# Altium schematic sheet Back Panel.schdoc
size 137 x 83 mm
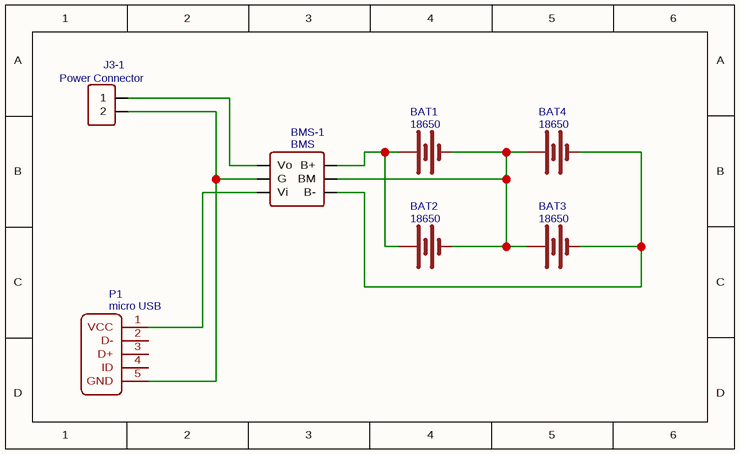
[diagram p0: Back Panel.schdoc]

## Parts
BAT1  18650  [BATTERY_18650-HOLDER]
BAT2  18650  [BATTERY_18650-HOLDER]
BAT3  18650  [BATTERY_18650-HOLDER]
BAT4  18650  [BATTERY_18650-HOLDER]
BMS-1  BMS  [HDR-M-2.54_2X3]
J3-1  Power Connector  [HDR-M-2.54_1X2]
P1  micro USB  [MICROB USB]

## Nets
NetBAT1_GND@1: BAT1.GND@1(-) BAT2.GND@1(-) BAT3.PWR@1(+) BAT4.PWR@1(+) BMS-1.4(BM)
NetBAT1_PWR@1: BAT1.PWR@1(+) BAT2.PWR@1(+) BMS-1.2(B+)
NetBAT3_GND@1: BAT3.GND@1(-) BAT4.GND@1(-) BMS-1.6(B-)
NetBMS-1_1: BMS-1.1(Vo) J3-1.2(1)
NetBMS-1_3: BMS-1.3(G) J3-1.1(2) P1.5(GND)
NetBMS-1_5: BMS-1.5(Vi) P1.1(VCC)

Not connected (* = marked no-connect by the designer): P1 2(D-) 3(D+) 4(ID)

## Library data of the parts
BAT1-BAT4 = 18650: description: Battery Holders; Contributor: SparkFun; spicePre: B; spiceSymbolName: BATTERY18650
BMS-1 = BMS: Contributor: LCEDA_Lib; BOM_Supplier Part: C65114; BOM_Supplier: LCSC; spicePre: J; spiceSymbolName: HDR-M-2.54_2x3
J3-1 = Power Connector: Contributor: LCEDA_Lib; BOM_Supplier Part: C124375; BOM_Supplier: LCSC; spicePre: J; spiceSymbolName: HDR-M-2.54_1x2
P1 = micro USB: sourceId: 1T5FDZYC8; timeStamp: 1461675374; spicePre: P; spiceSymbolName: microB USB